# Altium schematic sheet sha2017_rev1_0_0_2.SchDoc: sha2017_rev1_0_0
size 409 x 282 mm; Date: 4/24/2017 5:59:01 PM; SheetNumber: 3
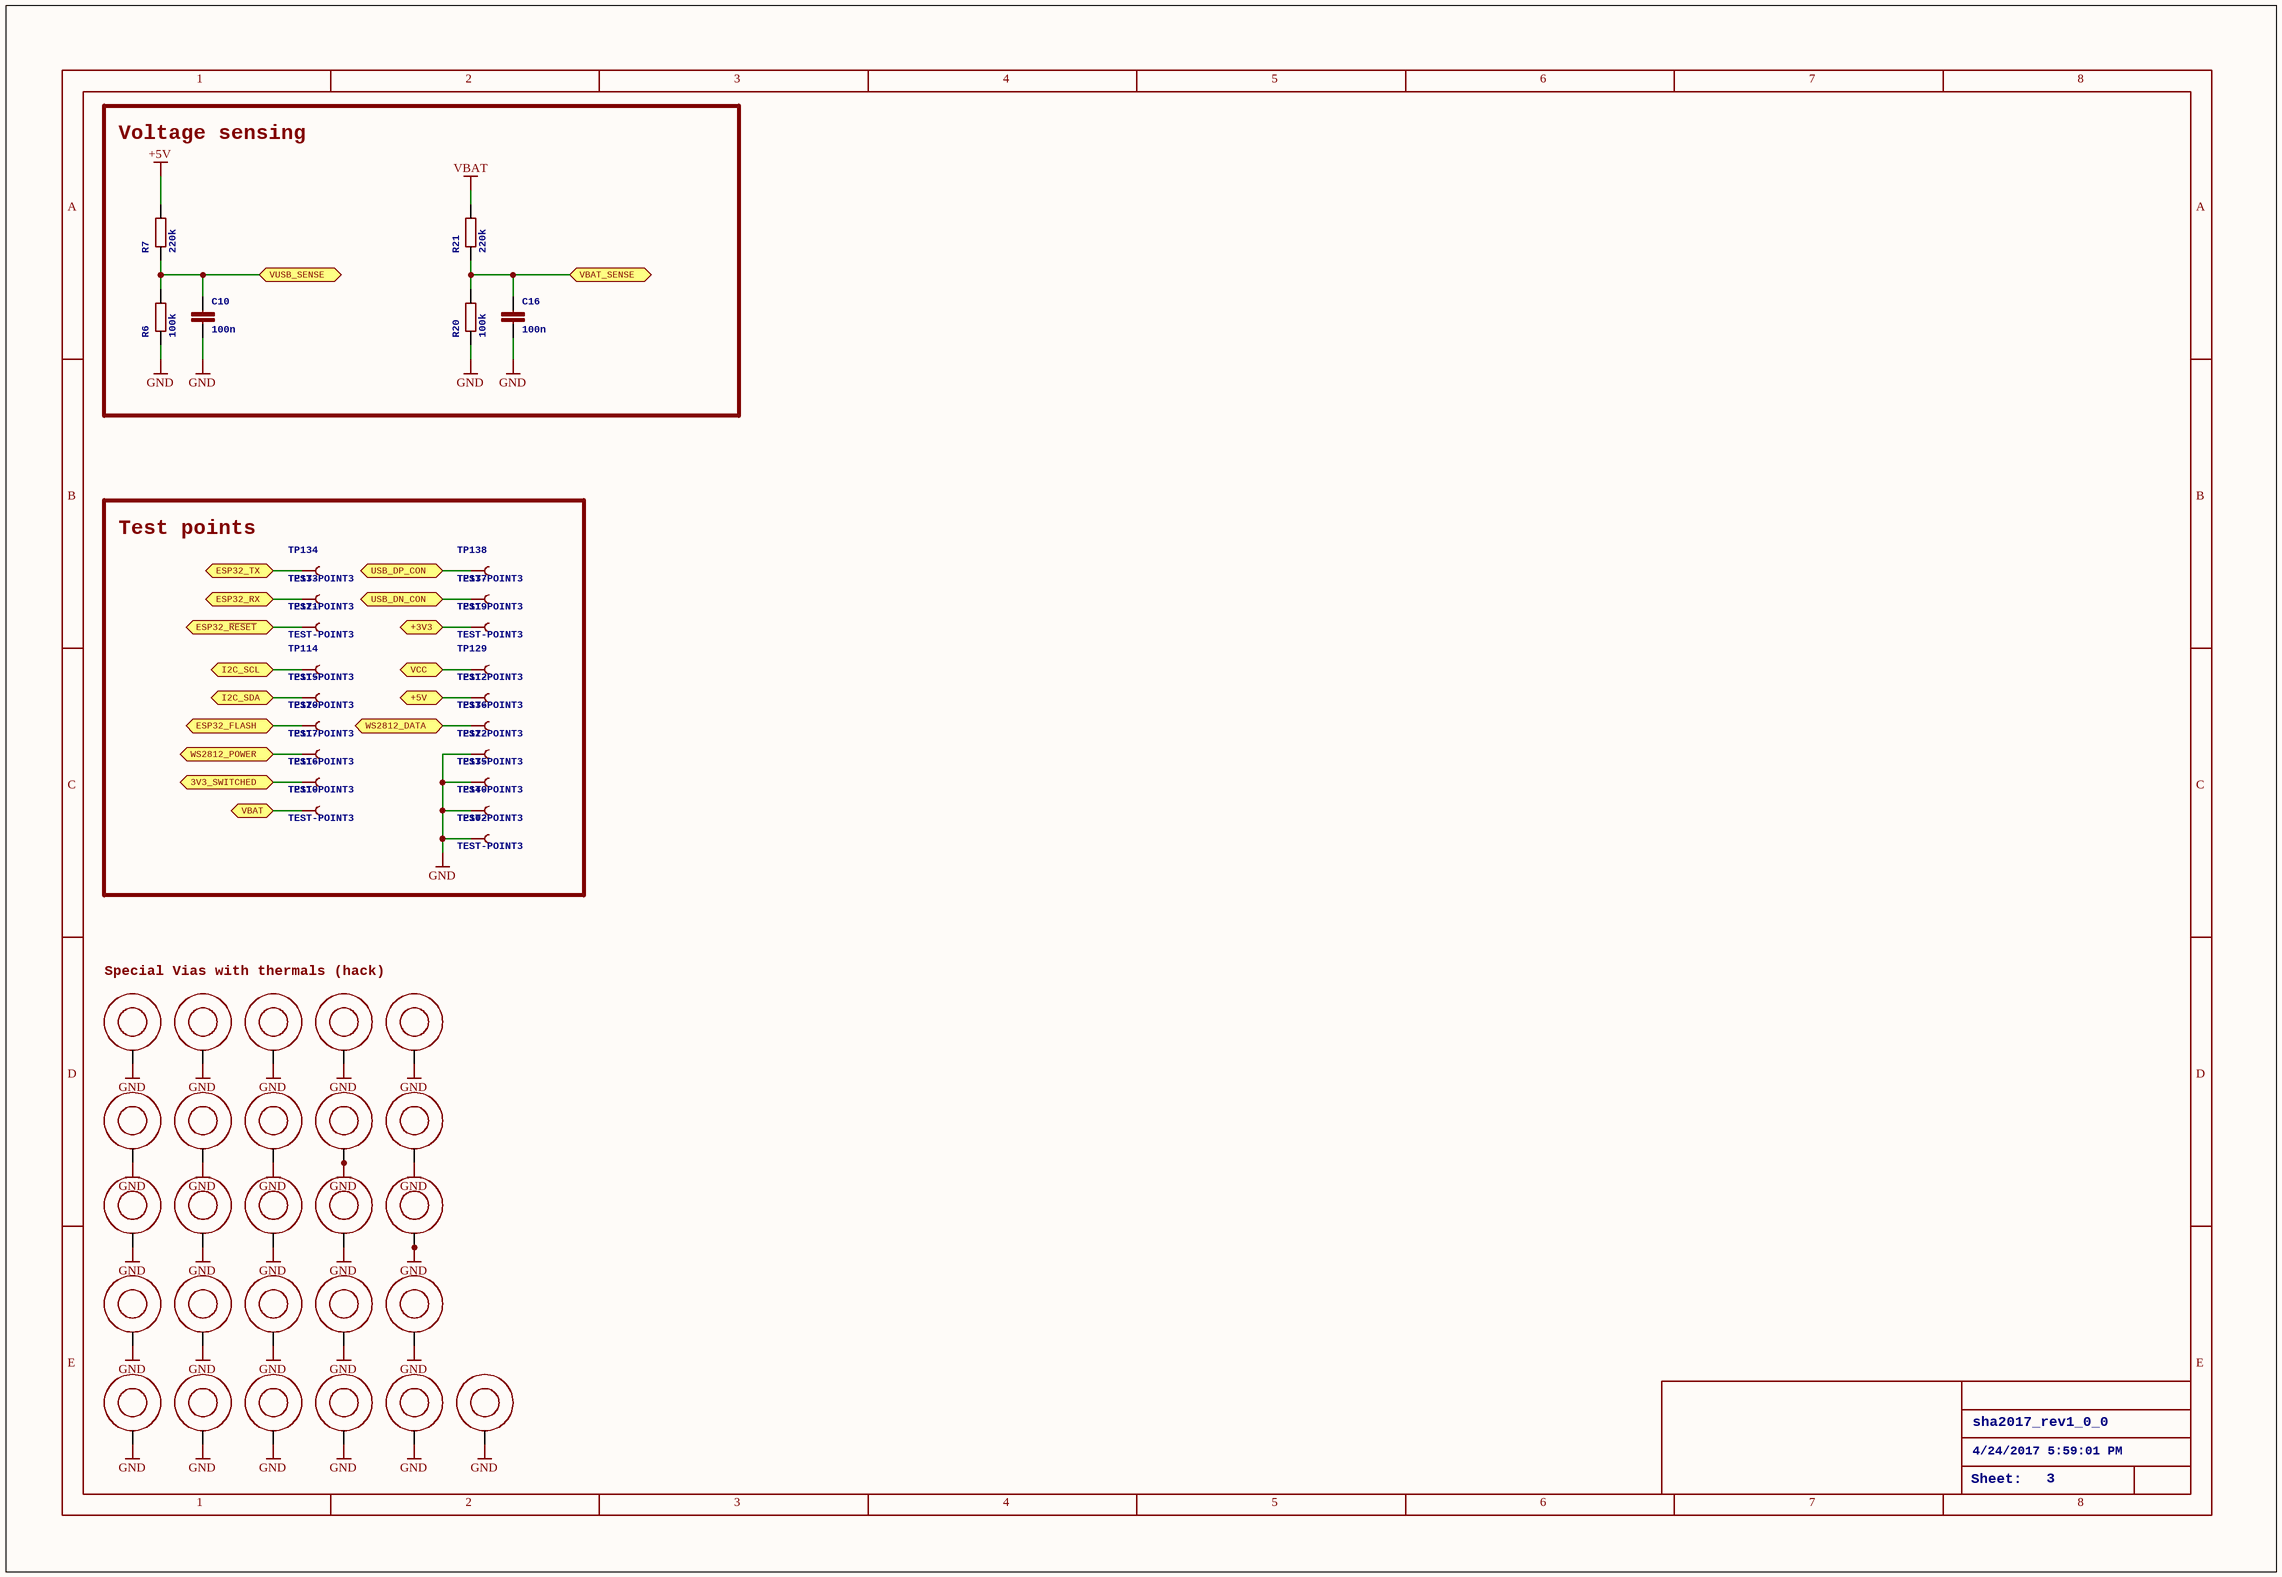
[diagram p0: sha2017_rev1_0_0_2.SchDoc]

## Parts
$$U$1  VIA  [VIA]  (value not drawn)
$$U$2  VIA  [VIA]  (value not drawn)
$$U$3  VIA  [VIA]  (value not drawn)
$$U$4  VIA  [VIA]  (value not drawn)
$$U$5  VIA  [VIA]  (value not drawn)
$$U$6  VIA  [VIA]  (value not drawn)
$$U$7  VIA  [VIA]  (value not drawn)
$$U$8  VIA  [VIA]  (value not drawn)
$$U$9  VIA  [VIA]  (value not drawn)
C10  100n  [C0603-DASHES]
C16  100n  [C0603-DASHES]
R6  100k  [R0603-DASHES]
R7  220k  [R0603-DASHES]
R20  100k  [R0603-DASHES]
R21  220k  [R0603-DASHES]
TP102  TEST-POINT3  [PAD.03X.03]
TP110  TEST-POINT3  [PAD.03X.03]
TP112  TEST-POINT3  [PAD.03X.03]
TP114  TEST-POINT3  [PAD.03X.03]
TP115  TEST-POINT3  [PAD.03X.03]
TP116  TEST-POINT3  [PAD.03X.03]
TP117  TEST-POINT3  [PAD.03X.03]
TP119  TEST-POINT3  [PAD.03X.03]
TP120  TEST-POINT3  [PAD.03X.03]
TP121  TEST-POINT3  [PAD.03X.03]
TP122  TEST-POINT3  [PAD.03X.03]
TP129  TEST-POINT3  [PAD.03X.03]
TP133  TEST-POINT3  [PAD.03X.03]
TP134  TEST-POINT3  [PAD.03X.03]
TP135  TEST-POINT3  [PAD.03X.03]
TP136  TEST-POINT3  [PAD.03X.03]
TP137  TEST-POINT3  [PAD.03X.03]
TP138  TEST-POINT3  [PAD.03X.03]
TP140  TEST-POINT3  [PAD.03X.03]
U$2  VIA  [VIA]  (value not drawn)
U$3  VIA  [VIA]  (value not drawn)
U$4  VIA  [VIA]  (value not drawn)
U$5  VIA  [VIA]  (value not drawn)
U$6  VIA  [VIA]  (value not drawn)
U$10  VIA  [VIA]  (value not drawn)
U$11  VIA  [VIA]  (value not drawn)
U$12  VIA  [VIA]  (value not drawn)
U$13  VIA  [VIA]  (value not drawn)
U$14  VIA  [VIA]  (value not drawn)
U$15  VIA  [VIA]  (value not drawn)
U$16  VIA  [VIA]  (value not drawn)
U$17  VIA  [VIA]  (value not drawn)
U$18  VIA  [VIA]  (value not drawn)
U$19  VIA  [VIA]  (value not drawn)
U$20  VIA  [VIA]  (value not drawn)
U$21  VIA  [VIA]  (value not drawn)
U$22  VIA  [VIA]  (value not drawn)
U$23  VIA  [VIA]  (value not drawn)

## Blocks framed on the sheet
Voltage sensing: C10 C16 R6 R7 R20 R21
Test points: TP102 TP110 TP112 TP114-TP117 TP119-TP122 TP129 TP133-TP138 TP140

## Ports
3V3_SWITCHED, +3V3, +5V, ESP32_FLASH, ESP32_RX, ESP32_TX, ESP32_~{RESET}, I2C_SCL, I2C_SDA, USB_DN_CON, USB_DP_CON, VBAT, VBAT_SENSE, VCC, VUSB_SENSE, WS2812_DATA, WS2812_POWER

## Nets
+5V: R7.2
GND: $$U$1.P$1 $$U$2.P$1 $$U$3.P$1 $$U$4.P$1 $$U$5.P$1 $$U$6.P$1 $$U$7.P$1 $$U$8.P$1 $$U$9.P$1 C10.2 C16.2 R6.1 R20.1 TP102.P$1 TP122.P$1 TP135.P$1 TP140.P$1 U$2.P$1 U$3.P$1 U$4.P$1 U$5.P$1 U$6.P$1 U$10.P$1 U$11.P$1 U$12.P$1 U$13.P$1 U$14.P$1 U$15.P$1 U$16.P$1 U$17.P$1 U$18.P$1 U$19.P$1 U$20.P$1 U$21.P$1 U$22.P$1 U$23.P$1
VBAT: R21.2
3V3_SWITCHED: TP116.P$1 ; port 3V3_SWITCHED
+3V3: TP119.P$1 ; port +3V3
+5V: TP112.P$1 ; port +5V  [a separate net that carries the same name]
ESP32_FLASH: TP120.P$1 ; port ESP32_FLASH
ESP32_~{RESET}: TP121.P$1 ; port ESP32_~{RESET}
ESP32_RX: TP133.P$1 ; port ESP32_RX
ESP32_TX: TP134.P$1 ; port ESP32_TX
I2C_SCL: TP114.P$1 ; port I2C_SCL
I2C_SDA: TP115.P$1 ; port I2C_SDA
USB_DN_CON: TP137.P$1 ; port USB_DN_CON
USB_DP_CON: TP138.P$1 ; port USB_DP_CON
VBAT: TP110.P$1 ; port VBAT  [a separate net that carries the same name]
VBAT_SENSE: C16.1 R20.2 R21.1 ; port VBAT_SENSE
VCC: TP129.P$1 ; port VCC
VUSB_SENSE: C10.1 R6.2 R7.1 ; port VUSB_SENSE
WS2812_DATA: TP136.P$1 ; port WS2812_DATA
WS2812_POWER: TP117.P$1 ; port WS2812_POWER

## Notes on the sheet
- Special Vias with thermals (hack)
- sha2017_rev1_0_0
- 4/24/2017 5:59:01 PM
- Sheet:
- 3
- 1
- 2
- 4
- 5
- 6
- 7
- 8
- A
- B
- C
- D
- E

## Library data of the parts
C10 C16 = C0603-DASHES: MF: *; MPN: *; OC_FARNELL: *; PARTNO: *
R6 R7 R20 R21 = R0603-DASHES: PARTNO: *
TP102 TP110 TP112 TP114-TP117 TP119-TP122 TP129 TP133-TP138 TP140 = TEST-POINT3: Bare copper test points for troubleshooting or ICT; PARTNO: *
$$U$1-$$U$9 U$2-U$6 U$10-U$23 = VIA: PARTNO: *